# Altium schematic sheet [2]Balancing.SchDoc
size A4 portrait; DocumentNumber: 3; SheetNumber: 3; SheetTotal: 5
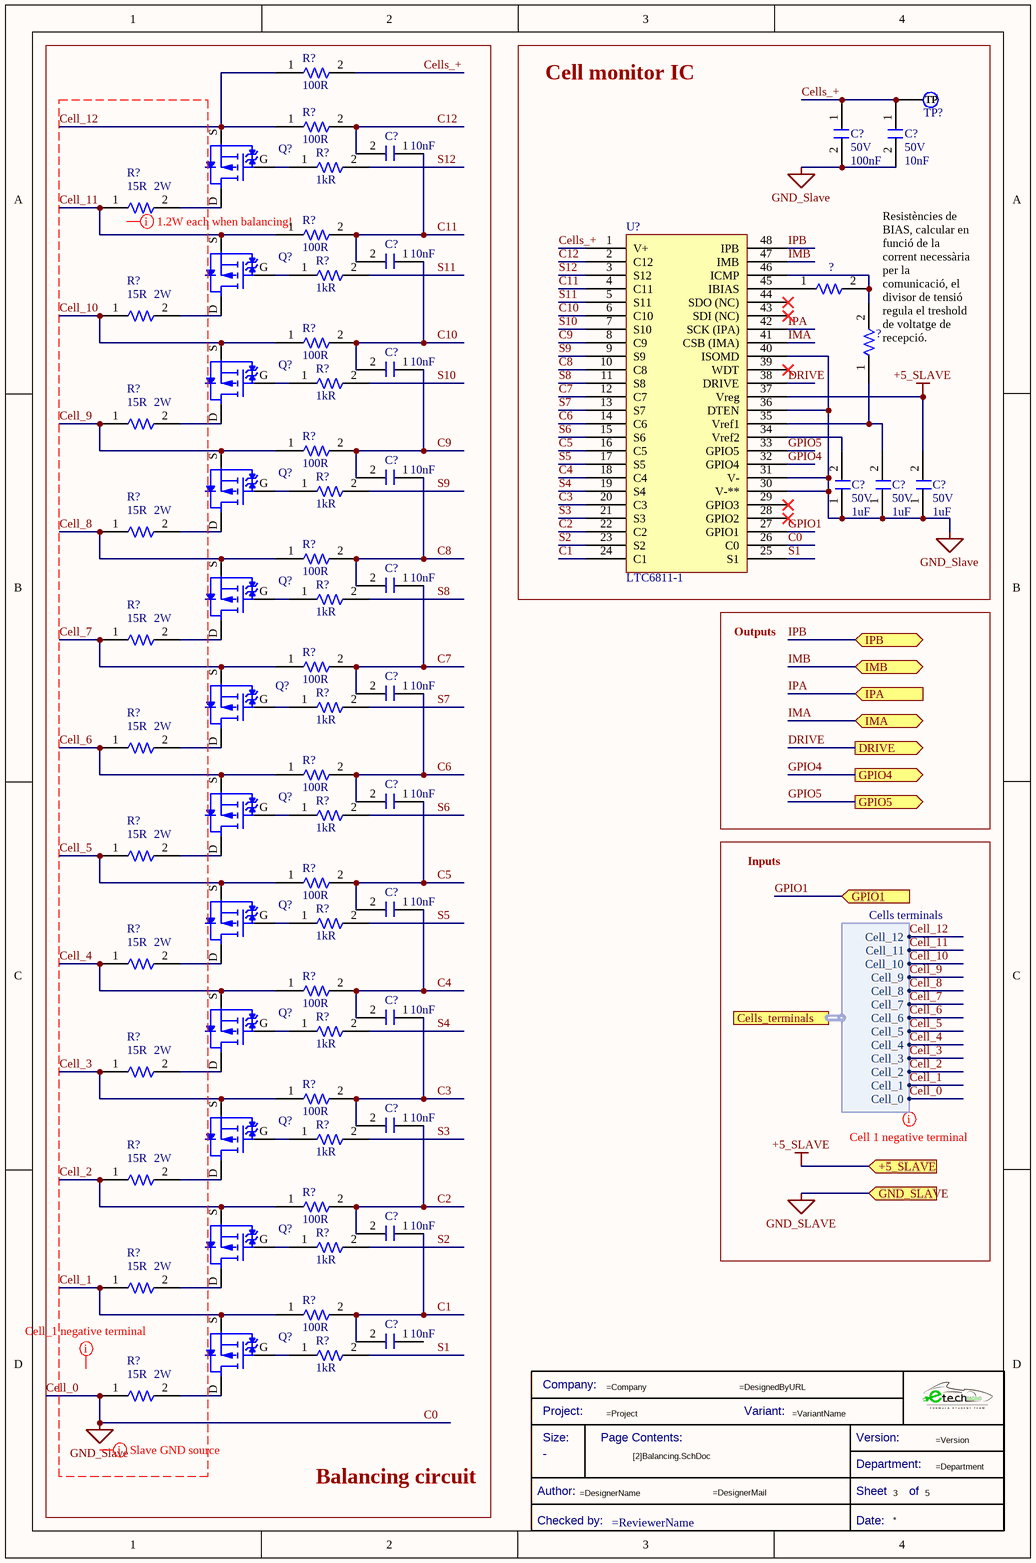
[diagram p0: [2]Balancing.SchDoc]

## Parts
(Parts that share a designator on the sheet are numbered #1, #2 ... from top to bottom, then left to right.)
*?  Title Block_template  (value not drawn)  (graphical)
?#1  ERJ-8GEYJ112V  [R1206FTK-W]  (value not drawn)
?#2  ERJ-8GEYJ112V  [R1206FTK-W]  (value not drawn)
C?#1  Voltage Rating: 50V  Capacitance: 100nF  [C0805FNPC-R]  (hidden comment: 885012207098)
C?#2  Voltage Rating: 50V  Capacitance: 10nF  [C0805FNPC-R]  (hidden comment: 885012207092)
C?#3  Capacitance: 10nF  [C0805FNPC-R]  (hidden comment: 885012207092)
C?#4  Capacitance: 10nF  [C0805FNPC-R]  (hidden comment: 885012207092)
C?#5  Capacitance: 10nF  [C0805FNPC-R]  (hidden comment: 885012207092)
C?#6  Capacitance: 10nF  [C0805FNPC-R]  (hidden comment: 885012207092)
C?#7  Voltage Rating: 50V  Capacitance: 1uF  [C0805FNPC-R]  (hidden comment: 885012207103)
C?#8  Voltage Rating: 50V  Capacitance: 1uF  [C0805FNPC-R]  (hidden comment: 885012207103)
C?#9  Voltage Rating: 50V  Capacitance: 1uF  [C0805FNPC-R]  (hidden comment: 885012207103)
C?#10  Capacitance: 10nF  [C0805FNPC-R]  (hidden comment: 885012207092)
C?#11  Capacitance: 10nF  [C0805FNPC-R]  (hidden comment: 885012207092)
C?#12  Capacitance: 10nF  [C0805FNPC-R]  (hidden comment: 885012207092)
C?#13  Capacitance: 10nF  [C0805FNPC-R]  (hidden comment: 885012207092)
C?#14  Capacitance: 10nF  [C0805FNPC-R]  (hidden comment: 885012207092)
C?#15  Capacitance: 10nF  [C0805FNPC-R]  (hidden comment: 885012207092)
C?#16  Capacitance: 10nF  [C0805FNPC-R]  (hidden comment: 885012207092)
C?#17  Capacitance: 10nF  [C0805FNPC-R]  (hidden comment: 885012207092)
Q?#1  BSS308PE  [TRT-PCH-2/30-BSS]  (value not drawn)
Q?#2  BSS308PE  [TRT-PCH-2/30-BSS]  (value not drawn)
Q?#3  BSS308PE  [TRT-PCH-2/30-BSS]  (value not drawn)
Q?#4  BSS308PE  [TRT-PCH-2/30-BSS]  (value not drawn)
Q?#5  BSS308PE  [TRT-PCH-2/30-BSS]  (value not drawn)
Q?#6  BSS308PE  [TRT-PCH-2/30-BSS]  (value not drawn)
Q?#7  BSS308PE  [TRT-PCH-2/30-BSS]  (value not drawn)
Q?#8  BSS308PE  [TRT-PCH-2/30-BSS]  (value not drawn)
Q?#9  BSS308PE  [TRT-PCH-2/30-BSS]  (value not drawn)
Q?#10  BSS308PE  [TRT-PCH-2/30-BSS]  (value not drawn)
Q?#11  BSS308PE  [TRT-PCH-2/30-BSS]  (value not drawn)
Q?#12  BSS308PE  [TRT-PCH-2/30-BSS]  (value not drawn)
R?#1  Resistance: 100R  [R0805FTK]  (hidden comment: CR0805-FX-1000ELF)
R?#2  Resistance: 100R  [R0805FTK]  (hidden comment: CR0805-FX-1000ELF)
R?#3  Resistance: 1kR  [R0805FTK]  (hidden comment: CR0805-JW-102ELF)
R?#4  value 15R  Max Power Dissipation: 2W  [R2512FTK]  (hidden comment: 352115RFT)
R?#5  Resistance: 100R  [R0805FTK]  (hidden comment: CR0805-FX-1000ELF)
R?#6  Resistance: 1kR  [R0805FTK]  (hidden comment: CR0805-JW-102ELF)
R?#7  value 15R  Max Power Dissipation: 2W  [R2512FTK]  (hidden comment: 352115RFT)
R?#8  Resistance: 100R  [R0805FTK]  (hidden comment: CR0805-FX-1000ELF)
R?#9  Resistance: 1kR  [R0805FTK]  (hidden comment: CR0805-JW-102ELF)
R?#10  value 15R  Max Power Dissipation: 2W  [R2512FTK]  (hidden comment: 352115RFT)
R?#11  Resistance: 100R  [R0805FTK]  (hidden comment: CR0805-FX-1000ELF)
R?#12  Resistance: 1kR  [R0805FTK]  (hidden comment: CR0805-JW-102ELF)
R?#13  value 15R  Max Power Dissipation: 2W  [R2512FTK]  (hidden comment: 352115RFT)
R?#14  Resistance: 100R  [R0805FTK]  (hidden comment: CR0805-FX-1000ELF)
R?#15  Resistance: 1kR  [R0805FTK]  (hidden comment: CR0805-JW-102ELF)
R?#16  value 15R  Max Power Dissipation: 2W  [R2512FTK]  (hidden comment: 352115RFT)
R?#17  Resistance: 100R  [R0805FTK]  (hidden comment: CR0805-FX-1000ELF)
R?#18  Resistance: 1kR  [R0805FTK]  (hidden comment: CR0805-JW-102ELF)
R?#19  value 15R  Max Power Dissipation: 2W  [R2512FTK]  (hidden comment: 352115RFT)
R?#20  Resistance: 100R  [R0805FTK]  (hidden comment: CR0805-FX-1000ELF)
R?#21  Resistance: 1kR  [R0805FTK]  (hidden comment: CR0805-JW-102ELF)
R?#22  value 15R  Max Power Dissipation: 2W  [R2512FTK]  (hidden comment: 352115RFT)
R?#23  Resistance: 100R  [R0805FTK]  (hidden comment: CR0805-FX-1000ELF)
R?#24  Resistance: 1kR  [R0805FTK]  (hidden comment: CR0805-JW-102ELF)
R?#25  value 15R  Max Power Dissipation: 2W  [R2512FTK]  (hidden comment: 352115RFT)
R?#26  Resistance: 100R  [R0805FTK]  (hidden comment: CR0805-FX-1000ELF)
R?#27  Resistance: 1kR  [R0805FTK]  (hidden comment: CR0805-JW-102ELF)
R?#28  value 15R  Max Power Dissipation: 2W  [R2512FTK]  (hidden comment: 352115RFT)
R?#29  Resistance: 100R  [R0805FTK]  (hidden comment: CR0805-FX-1000ELF)
R?#30  Resistance: 1kR  [R0805FTK]  (hidden comment: CR0805-JW-102ELF)
R?#31  value 15R  Max Power Dissipation: 2W  [R2512FTK]  (hidden comment: 352115RFT)
R?#32  Resistance: 100R  [R0805FTK]  (hidden comment: CR0805-FX-1000ELF)
R?#33  Resistance: 1kR  [R0805FTK]  (hidden comment: CR0805-JW-102ELF)
R?#34  value 15R  Max Power Dissipation: 2W  [R2512FTK]  (hidden comment: 352115RFT)
R?#35  Resistance: 100R  [R0805FTK]  (hidden comment: CR0805-FX-1000ELF)
R?#36  Resistance: 1kR  [R0805FTK]  (hidden comment: CR0805-JW-102ELF)
R?#37  value 15R  Max Power Dissipation: 2W  [R2512FTK]  (hidden comment: 352115RFT)
TP?  TestPoint  [TestPoint]  (value not drawn)  (no BOM)
U?  LTC6811-1  [U_LTC6811G-2]

## Blocks framed on the sheet
Balancing circuit: C?#3-C?#6 C?#10-C?#17 Q?#1-Q?#12 R?#1-R?#37
Cell monitor IC: ?#1 ?#2 C?#1 C?#2 C?#7-C?#9 TP? U?

## Ports
+5_SLAVE (in), Cells_terminals (harness Cells terminals), DRIVE (out), GND_SLAVE (in), GPIO1 (in), GPIO4 (out), GPIO5 (out), IMA (bidir), IMB (bidir), IPA (in), IPB (bidir)

## Harnesses
Cells terminals: Cell_0, Cell_1, Cell_2, Cell_3, Cell_4, Cell_5, Cell_6, Cell_7, Cell_8, Cell_9, Cell_10, Cell_11, Cell_12

## Nets
+5_SLAVE: C?#9.2 U?.37(Vreg) ; port +5_SLAVE
C0: C?#1.2 C?#2.2 C?#7.1 C?#8.1 C?#9.1 R?#37.1 U?.26(C0) U?.30(V-**) U?.31(V-) U?.36(DTEN) U?.40(ISOMD) ; port GND_SLAVE, port Cells_terminals.Cell_0  [also labelled Cell_0, GND_Slave]
C1: C?#16.1 C?#17.2 R?#35.2 U?.24(C1)
C2: C?#15.1 C?#16.2 R?#32.2 U?.22(C2)
C3: C?#14.1 C?#15.2 R?#29.2 U?.20(C3)
C4: C?#13.1 C?#14.2 R?#26.2 U?.18(C4)
C5: C?#12.1 C?#13.2 R?#23.2 U?.16(C5)
C6: C?#11.1 C?#12.2 R?#20.2 U?.14(C6)
C7: C?#10.1 C?#11.2 R?#17.2 U?.12(C7)
C8: C?#6.1 C?#10.2 R?#14.2 U?.10(C8)
C9: C?#5.1 C?#6.2 R?#11.2 U?.8(C9)
C10: C?#4.1 C?#5.2 R?#8.2 U?.6(C10)
C11: C?#3.1 C?#4.2 R?#5.2 U?.4(C11)
C12: C?#3.2 R?#2.2 U?.2(C12)
Cell_1: Q?#12.S R?#34.1 R?#35.1 ; port Cells_terminals.Cell_1
Cell_2: Q?#11.S R?#31.1 R?#32.1 ; port Cells_terminals.Cell_2
Cell_3: Q?#10.S R?#28.1 R?#29.1 ; port Cells_terminals.Cell_3
Cell_4: Q?#9.S R?#25.1 R?#26.1 ; port Cells_terminals.Cell_4
Cell_5: Q?#8.S R?#22.1 R?#23.1 ; port Cells_terminals.Cell_5
Cell_6: Q?#7.S R?#19.1 R?#20.1 ; port Cells_terminals.Cell_6
Cell_7: Q?#6.S R?#16.1 R?#17.1 ; port Cells_terminals.Cell_7
Cell_8: Q?#5.S R?#13.1 R?#14.1 ; port Cells_terminals.Cell_8
Cell_9: Q?#4.S R?#10.1 R?#11.1 ; port Cells_terminals.Cell_9
Cell_10: Q?#3.S R?#7.1 R?#8.1 ; port Cells_terminals.Cell_10
Cell_11: Q?#2.S R?#4.1 R?#5.1 ; port Cells_terminals.Cell_11
Cell_12: Q?#1.S R?#1.1 R?#2.1 ; port Cells_terminals.Cell_12
Cells_+: C?#1.1 C?#2.1 R?#1.2 TP?.1(TP) U?.1(V+)
DRIVE: U?.38(DRIVE) ; port DRIVE
GPIO1: U?.27(GPIO1) ; port GPIO1
GPIO4: U?.32(GPIO4) ; port GPIO4
GPIO5: U?.33(GPIO5) ; port GPIO5
IMA: U?.41(CSB_(IMA)) ; port IMA
IMB: U?.47(IMB) ; port IMB
IPA: U?.42(SCK_(IPA)) ; port IPA
IPB: U?.48(IPB) ; port IPB
S1: R?#36.2 U?.25(S1)
S2: R?#33.2 U?.23(S2)
S3: R?#30.2 U?.21(S3)
S4: R?#27.2 U?.19(S4)
S5: R?#24.2 U?.17(S5)
S6: R?#21.2 U?.15(S6)
S7: R?#18.2 U?.13(S7)
S8: R?#15.2 U?.11(S8)
S9: R?#12.2 U?.9(S9)
S10: R?#9.2 U?.7(S10)
S11: R?#6.2 U?.5(S11)
S12: R?#3.2 U?.3(S12)
Net?#1_1: ?#1.1 U?.45(IBIAS)
Net?#1_2: ?#1.2 ?#2.2 U?.46(ICMP)
Net?#2_1: ?#2.1 C?#8.2 U?.35(Vref1)
NetC?#7_2: C?#7.2 U?.34(Vref2)
NetQ?#1_D: Q?#1.D R?#4.2
NetQ?#1_G: Q?#1.G R?#3.1
NetQ?#2_D: Q?#2.D R?#7.2
NetQ?#2_G: Q?#2.G R?#6.1
NetQ?#3_D: Q?#3.D R?#10.2
NetQ?#3_G: Q?#3.G R?#9.1
NetQ?#4_D: Q?#4.D R?#13.2
NetQ?#4_G: Q?#4.G R?#12.1
NetQ?#5_D: Q?#5.D R?#16.2
NetQ?#5_G: Q?#5.G R?#15.1
NetQ?#6_D: Q?#6.D R?#19.2
NetQ?#6_G: Q?#6.G R?#18.1
NetQ?#7_D: Q?#7.D R?#22.2
NetQ?#7_G: Q?#7.G R?#21.1
NetQ?#8_D: Q?#8.D R?#25.2
NetQ?#8_G: Q?#8.G R?#24.1
NetQ?#9_D: Q?#9.D R?#28.2
NetQ?#9_G: Q?#9.G R?#27.1
NetQ?#10_D: Q?#10.D R?#31.2
NetQ?#10_G: Q?#10.G R?#30.1
NetQ?#11_D: Q?#11.D R?#34.2
NetQ?#11_G: Q?#11.G R?#33.1
NetQ?#12_D: Q?#12.D R?#37.2
NetQ?#12_G: Q?#12.G R?#36.1

Not connected (* = marked no-connect by the designer): C?#17 1; U? 28(GPIO2)* 29(GPIO3)* 39(WDT)* 43(SDI_(NC))* 44(SDO_(NC))*

## Layout directives
mark named Slave GND source: Cell_1, Cell_2, Cell_3, Cell_4, Cell_5, Cell_6, Cell_7, Cell_8, Cell_9, Cell_10, Cell_11, Cell_12, GND_Slave
mark named 1.2W each when balancing!: Cell_1, Cell_2, Cell_3, Cell_4, Cell_5, Cell_6, Cell_7, Cell_8, Cell_9, Cell_10, Cell_11, Cell_12, GND_Slave
mark named Cell_1 negative terminal: Cell_1, Cell_2, Cell_3, Cell_4, Cell_5, Cell_6, Cell_7, Cell_8, Cell_9, Cell_10, Cell_11, Cell_12, GND_Slave
mark named Cell 1 negative terminal: C0

## Notes on the sheet
- (near ?#2) Resistències de BIAS, calcular en funció de la corrent necessària per la comunicació, el divisor de tensió regula el treshold de voltatge de recepció.
- Outputs
- Inputs
- (in symbol Title Block_template) Company:; Project:; Variant:; Size:; Page Contents:; Version:; Department:; Author:; Sheet; of; Checked by:; Date:

## Library data of the parts
*? = Title Block_template: Standard Title Block; .Creator: GP; Category: Title Block; .PCBcheck: GP; .SCHcheck: GP; Checked by:: =ReviewerName; Size: -
?#1 ?#2 = R1k1-1206FTK: Res Thick Film 1206 1.1K Ohm 5% 0.25W ±200ppm/°C Molded SMD Punched Carrier T/R; Manufacturer: Panasonic; Power Rating: 250mW; Voltage Rating: 200V; .Creator: DO; Supplier 1: Newark; Manufacturer Part Number: ERJ-8GEYJ112V; RoHS: Yes; Category: Chip SMD Resistors; Stock 1: 9980; Pricing 1: 10=0,12700, 25=0,10100, 50=0,07500, 100=0,05000 (USD); Mount: Surface Mount; Case/Package: 1206; Contact Plating: Tin; Case Code (Metric): 3216; Case Code (Imperial): 1206; Min Operating Temperature: -55°C; Max Operating Temperature: 155°C; Tolerance: 5%; Resistor Type: Thick Film; Temperature Coefficient: 200ppm/°C; Packaging: Tape and Reel; Package Quantity: 1; Number of Terminations: 2; Max Power Dissipation: 250mW; Voltage Rating (DC): 200V; Features: Automotive AEC-Q200; Series: ERJ; Resistance Tolerance: 5%; Construction: Rectangular; Length: 3.2mm; Width: 0.063inch; Height: 0.028inch; Depth: 1.6mm; Radiation Hardening: No; REACH SVHC: No SVHC; Military Standard: Not; Lead Free: Lead Free; RoHS Compliant: Yes; ComponentLink1URL: https://datasheet.ciiva.com/5868/1500035-5868231.pdf?src-supplier=Farnell; ComponentLink1Description: https://datasheet.ciiva.com/5868/1500035-5868231.pdf?src-supplier=Farnell; ComponentLink2URL: https://datasheet.ciiva.com/17215/aoa0000ce1-17215127.pdf?src-supplier=Avnet+Europe; ComponentLink2Description: https://datasheet.ciiva.com/17215/aoa0000ce1-17215127.pdf?src-supplier=Avnet+Europe; ComponentLink3URL: https://datasheet.ciiva.com/46387/1500035-46387306.pdf?src-supplier=Element14; ComponentLink3Description: https://datasheet.ciiva.com/46387/1500035-46387306.pdf?src-supplier=Element14; ComponentLink4URL: https://datasheet.ciiva.com/9198/aoa0000ce1-9198847.pdf?src-supplier=Avnet; ComponentLink4Description: https://datasheet.ciiva.com/9198/aoa0000ce1-9198847.pdf?src-supplier=Avnet; Supplier Part Number 1: 63W1481; ComponentLink5Description: Where buy it; ComponentLink5URL: https://www.mouser.es/ProductDetail/Panasonic/ERJ-8GEYJ112V?qs=1VWA5LkbEaqqGx1BXqOkLA%3D%3D
C?#1 = C100n-50V-0805FNPC-X7R: Cap, 0.1ΜF, 50V, 10%, X7R, 0805; Manufacturer 1: Wurth Electronics; .Creator: DR; Supplier 1: RSComponents; Manufacturer Part Number 1: 885012207098; RoHS: Yes; Category: Ceramic Capacitors; Stock 1: 8000; Pricing 1: 100=0,10200, 500=0,07100, 2000=0,06100 (GBP); Mount: Surface Mount; Case/Package: 0805; Case Code (Metric): 2012; Case Code (Imperial): 0805; Min Operating Temperature: -55°C; Max Operating Temperature: 125°C; Packaging: Cut Tape; Dielectric: X7R; Tolerance: 10%; Voltage Rating (DC): 50V; Length: 0.079inch; Width: 0.049inch; Thickness: 0.035inch; REACH SVHC: Unknown; RoHS Compliant: Yes; ComponentLink1URL: http://www.farnell.com/datasheets/1958498.pdf?src-supplier=Farnell; ComponentLink1Description: http://www.farnell.com/datasheets/1958498.pdf?src-supplier=Farnell; ComponentLink2URL: http://www.farnell.com/datasheets/1958498.pdf?src-supplier=Element14; ComponentLink2Description: http://www.farnell.com/datasheets/1958498.pdf?src-supplier=Element14; ComponentLink3URL: https://katalog.we-online.de/pbs/datasheet/885012207098.pdf?src-supplier=Digi-Key; ComponentLink3Description: https://katalog.we-online.de/pbs/datasheet/885012207098.pdf?src-supplier=Digi-Key; ComponentLink4URL: http://www.farnell.com/datasheets/1958498.pdf?src-supplier=Newark; ComponentLink4Description: http://www.farnell.com/datasheets/1958498.pdf?src-supplier=Newark; Supplier Part Number 1: 1813493
C?#2-C?#6 C?#10-C?#17 = C10n-50V-0805FNPC-X7R: Cap, 0.01ΜF, 50V, 10%, X7R, 0805; Manufacturer 1: Wurth Electronics; .Creator: DR; Supplier 1: RSComponents; Manufacturer Part Number 1: 885012207092; RoHS: Yes; Category: Ceramic Capacitors; Stock 1: 1; Pricing 1: 4000=0,03200, 12000=0,03100 (USD); Mount: Surface Mount; Case/Package: 0805; Case Code (Metric): 2012; Case Code (Imperial): 0805; Min Operating Temperature: -55°C; Max Operating Temperature: 125°C; Packaging: Cut Tape; Dielectric: X7R; Tolerance: 10%; Voltage Rating (DC): 50V; Length: 0.079inch; Width: 0.049inch; Thickness: 0.035inch; REACH SVHC: Unknown; RoHS Compliant: Yes; ComponentLink1URL: http://www.farnell.com/datasheets/1958497.pdf?src-supplier=Farnell; ComponentLink1Description: http://www.farnell.com/datasheets/1958497.pdf?src-supplier=Farnell; ComponentLink2URL: http://www.farnell.com/datasheets/1958497.pdf?src-supplier=Element14; ComponentLink2Description: http://www.farnell.com/datasheets/1958497.pdf?src-supplier=Element14; ComponentLink3URL: http://www.farnell.com/datasheets/1958497.pdf?src-supplier=Newark; ComponentLink3Description: http://www.farnell.com/datasheets/1958497.pdf?src-supplier=Newark; ComponentLink4URL: https://katalog.we-online.de/pbs/datasheet/885012207092.pdf?src-supplier=Digi-Key; ComponentLink4Description: https://katalog.we-online.de/pbs/datasheet/885012207092.pdf?src-supplier=Digi-Key; Supplier Part Number 1: 1813941
  C?#3-C?#6 C?#10-C?#17: Voltage Rating: 50V
C?#7-C?#9 = C1u-50V-0805FNPC-X7R: Multilayer Ceramic Capacitor, Wcap-Csgp Series, 1 F, 10%, X7R, 50 V, 0805 [2012 Metric] Rohs Compliant: Yes; Manufacturer 1: Wurth Electronics; .Creator: GP; Supplier 1: RSComponents; Manufacturer Part Number 1: 885012207103; RoHS: Yes; Category: Ceramic Capacitors; Stock 1: 5100; Pricing 1: 50=0,27200, 250=0,25300, 500=0,22800, 1250=0,20100, 2500=0,17100 (GBP); Mount: Surface Mount; Case/Package: 0805; Case Code (Metric): 2012; Case Code (Imperial): 0805; Min Operating Temperature: -55°C; Max Operating Temperature: 85°C; Packaging: Cut Tape; Dielectric: X7R; Tolerance: 10%; Voltage Rating (DC): 50V; Length: 0.079inch; Width: 0.049inch; Thickness: 0.053inch; REACH SVHC: Unknown; RoHS Compliant: Yes; ComponentLink1URL: http://www.farnell.com/datasheets/1958501.pdf?src-supplier=Farnell; ComponentLink1Description: http://www.farnell.com/datasheets/1958501.pdf?src-supplier=Farnell; ComponentLink2URL: http://www.farnell.com/datasheets/1958501.pdf?src-supplier=Element14; ComponentLink2Description: http://www.farnell.com/datasheets/1958501.pdf?src-supplier=Element14; ComponentLink3URL: https://katalog.we-online.de/pbs/datasheet/885012107003.pdf?src-supplier=Digi-Key; ComponentLink3Description: https://katalog.we-online.de/pbs/datasheet/885012107003.pdf?src-supplier=Digi-Key; ComponentLink4URL: http://www.farnell.com/datasheets/1958501.pdf?src-supplier=Newark; ComponentLink4Description: http://www.farnell.com/datasheets/1958501.pdf?src-supplier=Newark; Supplier Part Number 1: 1813523
Q?#1-Q?#12 = TRT-PCH-2/30-BSS: Infineon’s highly innovative OptiMOS™ families include p-channel power MOSFETs, SOT-23-3, RoHS; Manufacturer Part Number: BSS308PEH6327; Continuous Drain Current (ID): 2A; Input Capacitance: 500pF; Drain to Source Voltage (Vdss): 30V; Max Power Dissipation: 500mW; Gate to Source Voltage (Vgs): 20V; Rds On Max: 80mR; Rise Time: 7.7ns; Turn-Off Delay Time: 15.3ns; Fall Time: 2.8ns; Turn-On Delay Time: 5.6ns; Threshold Voltage: -1.5V; .Creator: DO; Supplier 1: RSComponents; Manufacturer: Infineon; RoHS: Yes; Category: MOSFETs; Stock 1: 4000; Pricing 1: 50=0,50300, 100=0,26400, 250=0,25900, 500=0,25200, 1000=0,24700 (USD); Mount: Surface Mount; Case/Package: TO-236-3; Number of Pins: 3; Min Operating Temperature: -55°C; Max Operating Temperature: 150°C; Packaging: Tape and Reel; Package Quantity: 1; Series: OptiMOS™; REACH SVHC: No SVHC; ComponentLink1URL: https://datasheet.ciiva.com/6379/infineon-bss308pe-ds-v02-03-en-6379920.pdf?src-supplier=Digi-Key; ComponentLink1Description: datasheet; ComponentLink2URL: https://datasheet.ciiva.com/11171/infineon-bss308pe-ds-v02-03-en-11171385.pdf?src-supplier=Avnet; ComponentLink2Description: https://datasheet.ciiva.com/11171/infineon-bss308pe-ds-v02-03-en-11171385.pdf?src-supplier=Avnet; Supplier Part Number 1: 8235500
R?#1 R?#2 R?#5 R?#8 R?#11 R?#14 R?#17 R?#20 R?#23 R?#26 R?#29 R?#32 R?#35 = R100-0805FTK: Res Thick Film 0805 100 Ohm 1% 1/8W ±100ppm/°C Molded SMD SMD Paper Tape on Plastic Reel; Manufacturer 1: Bourns; Power Rating: 125mW; Voltage Rating: 150V; .Creator: DR; Supplier 1: Arrow Electronics; Manufacturer Part Number 1: CR0805-FX-1000ELF; RoHS: Yes; Category: Chip SMD Resistors; Stock 1: 49802; Pricing 1: 1=0,05840, 10=0,03430, 25=0,01780, 100=0,00750, 250=0,00560, 500=0,00490, 3000=0,00470 (USD); Mount: Surface Mount; Case/Package: 0805; Number of Pins: 2; Contact Plating: Tin; Case Code (Imperial): 0805; Case Code (Metric): 2012; Min Operating Temperature: -55°C; Max Operating Temperature: 155°C; Tolerance: 1%; Resistor Type: Thick Film; Temperature Coefficient: 100ppm/°C; Packaging: Tape and Reel; Package Quantity: 1; Termination: SMD/SMT; Number of Terminations: 2; Max Power Dissipation: 125mW; Voltage Rating (DC): 150V; Features: Moisture Resistant; Series: CR0805; Resistance Tolerance: 1%; Construction: Rectangular; Technology: THICK FILM; Length: 2mm; Width: 1.25mm; Height: 0.5mm; Depth: 1.25mm; Thickness: 508um; Radiation Hardening: No; REACH SVHC: No SVHC; Military Standard: Not; RoHS Compliant: Yes; ComponentLink1URL: https://datasheet.ciiva.com/11809/0900766b80fcdb72-11809178.pdf?src-supplier=RSComponents; ComponentLink1Description: https://datasheet.ciiva.com/11809/0900766b80fcdb72-11809178.pdf?src-supplier=RSComponents; ComponentLink2URL: https://datasheet.ciiva.com/6547/chpreztr-6547413.pdf?src-supplier=Digi-Key; ComponentLink2Description: https://datasheet.ciiva.com/6547/chpreztr-6547413.pdf?src-supplier=Digi-Key; ComponentLink3URL: https://datasheet.ciiva.com/6547/chpreztr-6547414.pdf?src-supplier=Digi-Key; ComponentLink3Description: https://datasheet.ciiva.com/6547/chpreztr-6547414.pdf?src-supplier=Digi-Key; ComponentLink4URL: https://datasheet.ciiva.com/6547/chpreztr-6547415.pdf?src-supplier=Digi-Key; ComponentLink4Description: https://datasheet.ciiva.com/6547/chpreztr-6547415.pdf?src-supplier=Digi-Key; ComponentLink5URL: https://datasheet.ciiva.com/9120/chpreztr-9120744.pdf?src-supplier=Avnet; ComponentLink5Description: https://datasheet.ciiva.com/9120/chpreztr-9120744.pdf?src-supplier=Avnet; Supplier Part Number 1: CR0805-FX-1000ELF
R?#3 R?#6 R?#9 R?#12 R?#15 R?#18 R?#21 R?#24 R?#27 R?#30 R?#33 R?#36 = R1k-0805FTK: Res Thick Film 0805 1K Ohm 5% 1/8W ±200ppm/°C Molded SMD SMD Paper Tape on Plastic Reel; Manufacturer 1: Bourns; Voltage Rating (DC): 150V; Power Rating: 125mW; .Creator: GP; Supplier 1: Arrow Electronics; Manufacturer Part Number 1: CR0805-JW-102ELF; RoHS: Yes; Category: Chip SMD Resistors; Stock 1: 27510; Pricing 1: 1=0,05930, 10=0,03510, 25=0,01790, 100=0,00800, 250=0,00790, 500=0,00590, 1000=0,00360, 3000=0,00350, 6000=0,00250 (USD); Mount: Surface Mount; Case/Package: 0805; Number of Pins: 2; Contact Plating: Tin; Case Code (Metric): 2012; Case Code (Imperial): 0805; Min Operating Temperature: -55°C; Max Operating Temperature: 155°C; Resistor Type: Thick Film; Tolerance: 5%; Temperature Coefficient: 200ppm/°C; Features: Moisture Resistant; Package Quantity: 1; Packaging: Tape and Reel; Voltage Rating: 150V; Number of Terminations: 2; Termination: SMD/SMT; Max Power Dissipation: 125mW; Length: 2mm; Width: 1.25mm; Height: 0.5mm; Thickness: 508um; Depth: 1.25mm; Radiation Hardening: No; Lead Free: Lead Free; REACH SVHC: No SVHC; Military Standard: Not; ComponentLink1URL: https://datasheet.ciiva.com/11821/0900766b80fcdb72-11821134.pdf?src-supplier=RSComponents; ComponentLink1Description: https://datasheet.ciiva.com/11821/0900766b80fcdb72-11821134.pdf?src-supplier=RSComponents; ComponentLink2URL: https://datasheet.ciiva.com/15225/getdatasheetpartid-78155-15225381.pdf?src-supplier=Verical; ComponentLink2Description: https://datasheet.ciiva.com/15225/getdatasheetpartid-78155-15225381.pdf?src-supplier=Verical; ComponentLink3URL: https://datasheet.ciiva.com/22693/1902866-22693253.pdf?src-supplier=Element14; ComponentLink3Description: https://datasheet.ciiva.com/22693/1902866-22693253.pdf?src-supplier=Element14; ComponentLink4URL: https://datasheet.ciiva.com/7986/1856384-7986184.pdf?src-supplier=Element14; ComponentLink4Description: https://datasheet.ciiva.com/7986/1856384-7986184.pdf?src-supplier=Element14; ComponentLink5URL: https://datasheet.ciiva.com/7985/1856384-7985867.pdf?src-supplier=Element14; ComponentLink5Description: https://datasheet.ciiva.com/7985/1856384-7985867.pdf?src-supplier=Element14; ComponentLink6URL: https://datasheet.ciiva.com/30242/159chpreztr-30242765.pdf?src-supplier=Onlinecomponents.com; ComponentLink6Description: https://datasheet.ciiva.com/30242/159chpreztr-30242765.pdf?src-supplier=Onlinecomponents.com; ComponentLink7URL: https://datasheet.ciiva.com/6547/chpreztr-6547359.pdf?src-supplier=Digi-Key; ComponentLink7Description: https://datasheet.ciiva.com/6547/chpreztr-6547359.pdf?src-supplier=Digi-Key; Supplier Part Number 1: CR0805-JW-102ELF
R?#4 R?#7 R?#10 R?#13 R?#16 R?#19 R?#22 R?#25 R?#28 R?#31 R?#34 R?#37 = R15-2512FTK: Res Thick Film 2512 15 Ohm 1% 2W ±100ppm/C Pad SMD T/R; Manufacturer 1: TE Connectivity; Temperature Coefficient: 100ppm/°C; Voltage Rating: 250V; Number of Resistors: 1; .Creator: DR; ComponentLink1Description: Datasheet; ComponentLink1URL: https://docs.rs-online.com/8bc1/0900766b81096b90.pdf; ComponentLink2Description: Where buy it; ComponentLink2URL: https://es.rs-online.com/web/p/resistencias-de-montaje-en-superficie/7551110; Supplier 1: RSComponents; Manufacturer Part Number 1: 352115RFT; RoHS: Yes; Category: Chip SMD Resistors; Stock 1: 1; Pricing 1: 10=0,64300, 250=0,62200, 1000=0,60000, 2000=0,55400, 2500=0,52100 (USD); Mount: Surface Mount; Case/Package: 2512; Case Code (Metric): 6432; Case Code (Imperial): 2512; Min Operating Temperature: -55°C; Max Operating Temperature: 155°C; Packaging: Tape and Reel; Tolerance: 1%; Resistor Type: Thick Film,Power resistor; Number of Terminations: 2; Termination: Solder; Voltage Rating (DC): 250V; Features: Automotive AEC-Q200; Series: 3521, CGS; Technology: THICK FILM; Resistance Tolerance: 1%; Length: 6.3mm; Height: 0.55mm; Depth: 3.2mm; RoHS Compliant: Yes; REACH SVHC: No SVHC; ELV: Compliant; ComponentLink3URL: https://datasheet.ciiva.com/25610/0900766b81096b90-25610033.pdf?src-supplier=RSComponents; ComponentLink3Description: https://datasheet.ciiva.com/25610/0900766b81096b90-25610033.pdf?src-supplier=RSComponents; ComponentLink4URL: https://datasheet.ciiva.com/46391/1610601-46391493.pdf?src-supplier=Element14; ComponentLink4Description: https://datasheet.ciiva.com/46391/1610601-46391493.pdf?src-supplier=Element14; ComponentLink5URL: https://datasheet.ciiva.com/7657/1610601-7657542.pdf?src-supplier=Element14; ComponentLink5Description: https://datasheet.ciiva.com/7657/1610601-7657542.pdf?src-supplier=Element14; Supplier Part Number 1: 7551110P
TP? = TestPoint: Test Point 1x1 mm; .Creator: GP; Category: TestPoint; .PCBcheck: GP; .SCHcheck: GP
U? = U_LTC6811-1: Sc-Automotive Multicell Battery Stack Monitor With Addressable Isospi Interface; Manufacturer 1: Analog Devices; .Creator: GP; ComponentLink1URL: https://www.analog.com/media/en/technical-documentation/data-sheets/ltc6811-1-6811-2.pdf; ComponentLink1Description: Datasheet; ComponentLink2Description: Where buy it; ComponentLink2URL: https://www.mouser.es/ProductDetail/Analog-Devices/LTC6811IG-23ZZTRPBF?qs=byeeYqUIh0NWJgxDt7RX5g%3D%3D; Supplier 1: Digi-Key; Category: Battery Management; Pricing 1: 1=21,46000, 10=19,72200, 25=18,90400, 100=16,65600, 250=15,90600 (USD); RoHS Compliant: Yes; ComponentLink3URL: http://www.linear.com/docs/55980?src-supplier=Digi-Key; ComponentLink3Description: http://www.linear.com/docs/55980?src-supplier=Digi-Key; ComponentLink4URL: https://datasheet.octopart.com/LTC6811HG-1%23PBF-Analog-Devices-datasheet-138896417.pdf?src-supplier=Upverter; ComponentLink4Description: https://datasheet.octopart.com/LTC6811HG-1%23PBF-Analog-Devices-datasheet-138896417.pdf?src-supplier=Upverter; ComponentLink5URL: https://datasheet.octopart.com/LTC6811HG-1%23PBF-Linear-Technology-datasheet-66874450.pdf?src-supplier=Linear+Technology; ComponentLink5Description: https://datasheet.octopart.com/LTC6811HG-1%23PBF-Linear-Technology-datasheet-66874450.pdf?src-supplier=Linear+Technology; ComponentLink6URL: https://sigma.octopart.com/57702806/technical_drawing/Linear-Technology-LTC6811HG-1%23PBF.pdf?src-supplier=Linear+Technology; ComponentLink6Description: https://sigma.octopart.com/57702806/technical_drawing/Linear-Technology-LTC6811HG-1%23PBF.pdf?src-supplier=Linear+Technology; Supplier Part Number 1: 505-LTC6811HG-1#PBF-ND; Case/Package: SSOP; Manufacturer Part Number 1: LTC6811-1